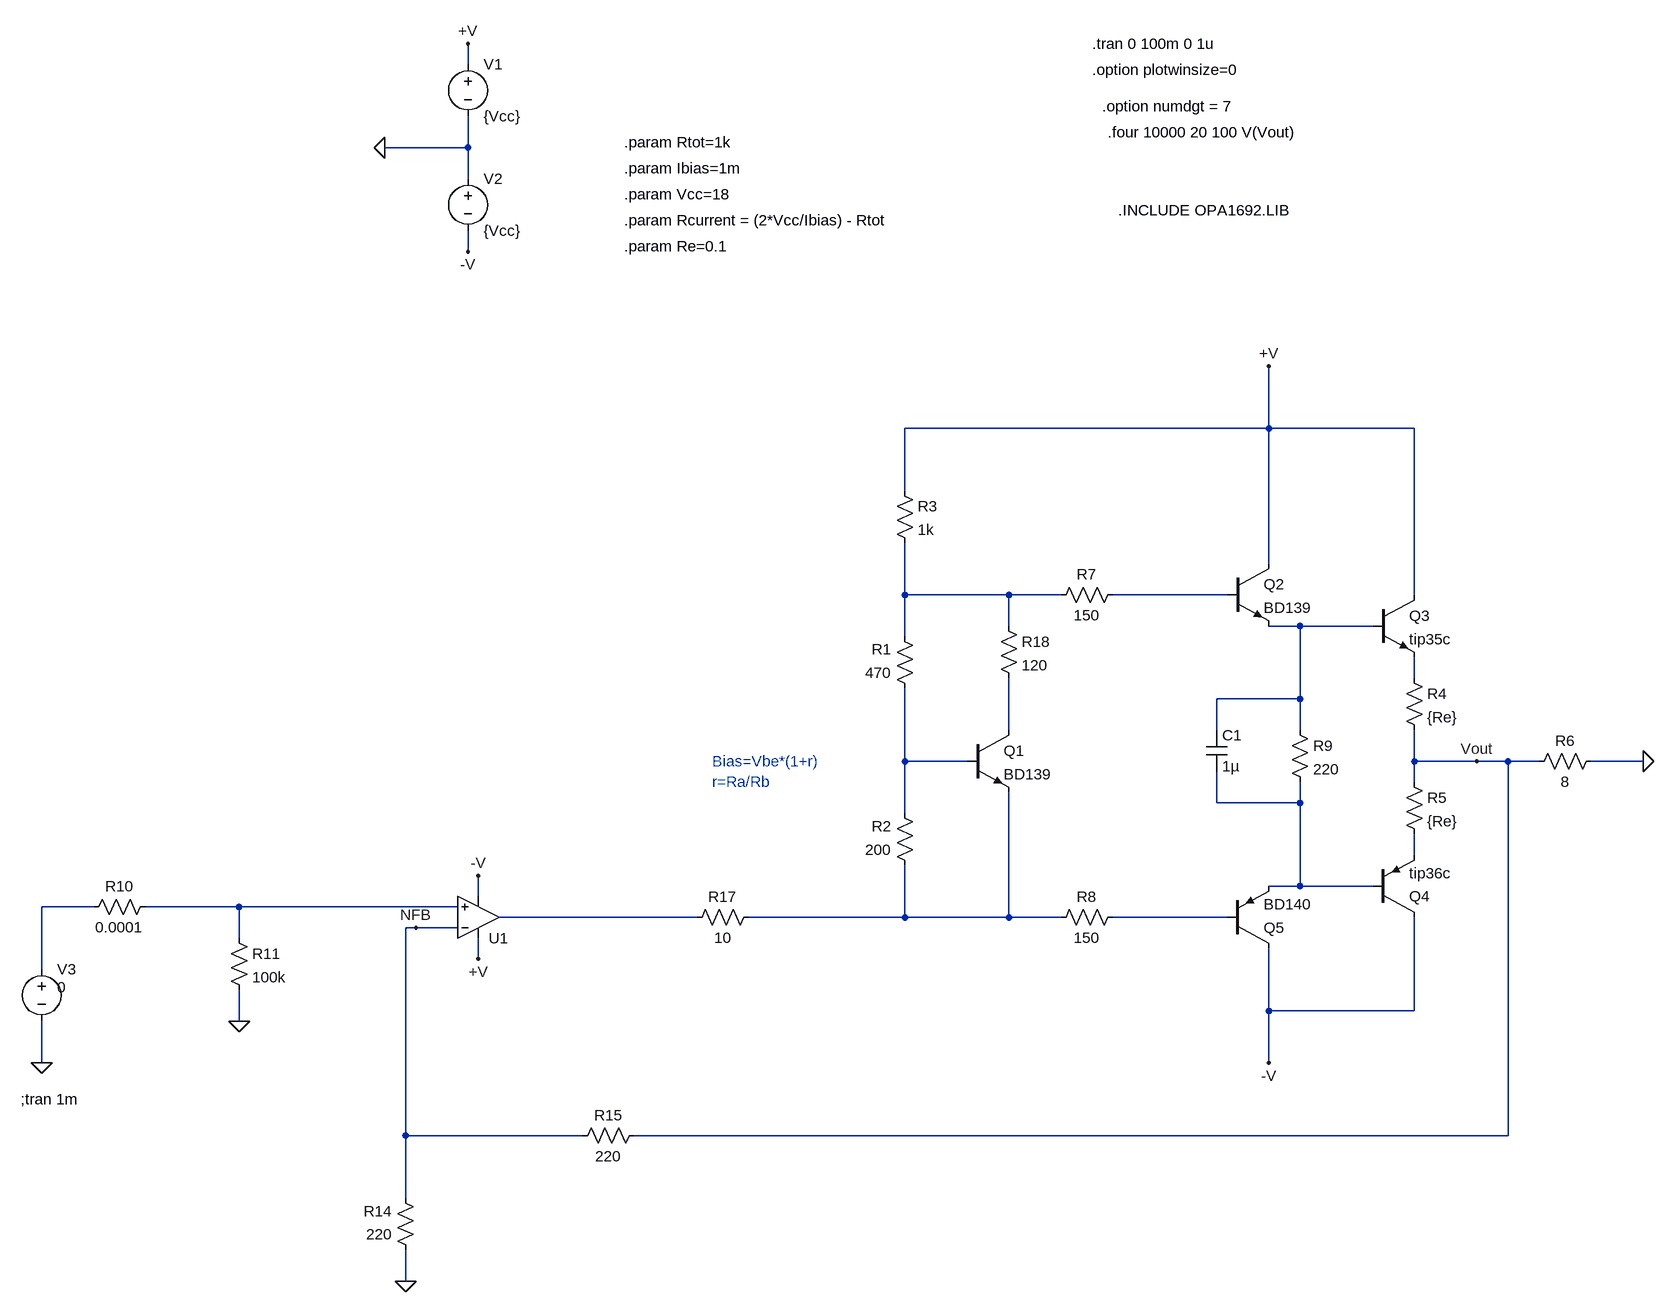
[diagram p0: schematic DC.asc]
DC.asc, the LTspice schematic file:
Version 4
SHEET 1 1236 2388
WIRE -592 -16 -592 -48
WIRE -592 112 -592 64
WIRE -592 112 -720 112
WIRE -592 160 -592 112
WIRE -592 272 -592 240
WIRE 640 544 640 448
WIRE 640 544 80 544
WIRE 864 544 640 544
WIRE 80 640 80 544
WIRE 640 752 640 544
WIRE 80 800 80 720
WIRE 240 800 80 800
WIRE 320 800 240 800
WIRE 576 800 400 800
WIRE 864 800 864 544
WIRE 240 848 240 800
WIRE 688 848 640 848
WIRE 800 848 688 848
WIRE 80 864 80 800
WIRE 864 928 864 896
WIRE 688 960 688 848
WIRE 688 960 560 960
WIRE 240 1008 240 928
WIRE 560 1008 560 960
WIRE 688 1008 688 960
WIRE 80 1056 80 944
WIRE 176 1056 80 1056
WIRE 864 1056 864 1008
WIRE 960 1056 864 1056
WIRE 1008 1056 960 1056
WIRE 1056 1056 1008 1056
WIRE 1216 1056 1136 1056
WIRE 864 1088 864 1056
WIRE 560 1120 560 1072
WIRE 688 1120 688 1088
WIRE 688 1120 560 1120
WIRE 80 1136 80 1056
WIRE 864 1200 864 1168
WIRE 688 1248 688 1120
WIRE 688 1248 640 1248
WIRE 800 1248 688 1248
WIRE -576 1264 -576 1232
WIRE -1168 1280 -1248 1280
WIRE -944 1280 -1088 1280
WIRE -608 1280 -944 1280
WIRE -240 1296 -544 1296
WIRE 80 1296 80 1216
WIRE 80 1296 -160 1296
WIRE 240 1296 240 1104
WIRE 240 1296 80 1296
WIRE 320 1296 240 1296
WIRE 576 1296 400 1296
WIRE -672 1312 -688 1312
WIRE -608 1312 -672 1312
WIRE -944 1328 -944 1280
WIRE -576 1360 -576 1328
WIRE -1248 1376 -1248 1280
WIRE 640 1440 640 1344
WIRE 864 1440 864 1296
WIRE 864 1440 640 1440
WIRE -944 1456 -944 1408
WIRE -1248 1520 -1248 1456
WIRE 640 1520 640 1440
WIRE -688 1632 -688 1312
WIRE -416 1632 -688 1632
WIRE 1008 1632 1008 1056
WIRE 1008 1632 -336 1632
WIRE -688 1728 -688 1632
WIRE -688 1856 -688 1808
FLAG -720 112 0
FLAG -592 -48 +V
FLAG -592 272 -V
FLAG 640 448 +V
FLAG 640 1520 -V
FLAG 1216 1056 0
FLAG 960 1056 Vout
FLAG -1248 1520 0
FLAG -576 1360 +V
FLAG -576 1232 -V
FLAG -944 1456 0
FLAG -672 1312 NFB
FLAG -688 1856 0
SYMBOL voltage -592 -32 R0
WINDOW 123 0 0 Left 0
WINDOW 39 0 0 Left 0
SYMATTR InstName V1
SYMATTR Value {Vcc}
SYMBOL voltage -592 144 R0
WINDOW 123 0 0 Left 0
WINDOW 39 0 0 Left 0
SYMATTR InstName V2
SYMATTR Value {Vcc}
SYMBOL res 96 960 R180
WINDOW 0 36 76 Left 2
WINDOW 3 36 40 Left 2
SYMATTR InstName R1
SYMATTR Value 470
SYMBOL res 96 1232 R180
WINDOW 0 36 76 Left 2
WINDOW 3 36 40 Left 2
SYMATTR InstName R2
SYMATTR Value 200
SYMBOL npn 176 1008 R0
SYMATTR InstName Q1
SYMATTR Value BD139
SYMBOL npn 576 752 R0
SYMATTR InstName Q2
SYMATTR Value BD139
SYMBOL npn 800 800 R0
SYMATTR InstName Q3
SYMATTR Value tip35c
SYMBOL res 64 624 R0
SYMATTR InstName R3
SYMATTR Value 1k
SYMBOL pnp 800 1296 M180
SYMATTR InstName Q4
SYMATTR Value tip36c
SYMBOL pnp 576 1344 M180
SYMATTR InstName Q5
SYMATTR Value BD140
SYMBOL res 848 912 R0
SYMATTR InstName R4
SYMATTR Value {Re}
SYMBOL res 848 1072 R0
SYMATTR InstName R5
SYMATTR Value {Re}
SYMBOL res 1152 1040 R90
WINDOW 0 0 56 VBottom 2
WINDOW 3 32 56 VTop 2
SYMATTR InstName R6
SYMATTR Value 8
SYMBOL res 416 784 R90
WINDOW 0 0 56 VBottom 2
WINDOW 3 32 56 VTop 2
SYMATTR InstName R7
SYMATTR Value 150
SYMBOL res 416 1280 R90
WINDOW 0 0 56 VBottom 2
WINDOW 3 32 56 VTop 2
SYMATTR InstName R8
SYMATTR Value 150
SYMBOL res 672 992 R0
SYMATTR InstName R9
SYMATTR Value 220
SYMBOL cap 544 1008 R0
SYMATTR InstName C1
SYMATTR Value 1µ
SYMBOL OpAmps\\opamp2 -576 1360 M180
WINDOW 3 16 96 Invisible 2
SYMATTR Value OPA1692
SYMATTR InstName U1
SYMBOL voltage -1248 1360 R0
WINDOW 123 24 124 Left 2
WINDOW 39 0 0 Left 0
WINDOW 3 24 44 Left 2
SYMATTR Value 0
SYMATTR InstName V3
SYMBOL res -1072 1264 R90
WINDOW 0 0 56 VBottom 2
WINDOW 3 32 56 VTop 2
SYMATTR InstName R10
SYMATTR Value 0.0001
SYMBOL res -960 1312 R0
SYMATTR InstName R11
SYMATTR Value 100k
SYMBOL res -672 1824 R180
WINDOW 0 36 76 Left 2
WINDOW 3 36 40 Left 2
SYMATTR InstName R14
SYMATTR Value 220
SYMBOL res -320 1616 R90
WINDOW 0 0 56 VBottom 2
WINDOW 3 32 56 VTop 2
SYMATTR InstName R15
SYMATTR Value 220
SYMBOL res -144 1280 R90
WINDOW 0 0 56 VBottom 2
WINDOW 3 32 56 VTop 2
SYMATTR InstName R17
SYMATTR Value 10
SYMBOL res 224 832 R0
SYMATTR InstName R18
SYMATTR Value 120
TEXT -352 104 Left 2 !.param Rtot=1k
TEXT -352 144 Left 2 !.param Ibias=1m
TEXT -352 184 Left 2 !.param Vcc=18
TEXT -352 224 Left 2 !.param Rcurrent = (2*Vcc/Ibias) - Rtot
TEXT -352 264 Left 2 !.param Re=0.1
TEXT 368 -48 Left 2 !.tran 0 100m 0 1u
TEXT 368 -8 Left 2 !.option plotwinsize=0
TEXT 384 48 Left 2 !.option numdgt = 7
TEXT 392 88 Left 2 !.four 10000 20 100 V(Vout)
TEXT 408 208 Left 2 !.INCLUDE OPA1692.LIB
TEXT -216 1056 Left 2 ;Bias=Vbe*(1+r)\nr=Ra/Rb
TEXT -1280 1576 Left 2 !;tran 1m

The netlist it stands for:
* DC.asc
V1 +V 0 {Vcc}
V2 0 -V {Vcc}
R1 N006 N001 470
R2 N012 N006 200
Q1 N005 N006 N012 0 BD139
Q2 +V N002 N003 0 BD139
Q3 +V N003 N004 0 tip35c
R3 +V N001 1k
Q4 -V N007 N008 0 tip36c
Q5 -V N013 N007 0 BD140
R4 N004 Vout {Re}
R5 Vout N008 {Re}
R6 0 Vout 8
R7 N002 N001 150
R8 N013 N012 150
R9 N003 N007 220
C1 N003 N007 1µ
XU1 N010 NFB +V -V N011 OPA1692  ; pins In+ In- V+ V- OUT
V3 N009 0 0
R10 N010 N009 0.0001
R11 N010 0 100k
R14 0 NFB 220
R15 Vout NFB 220
R17 N012 N011 10
R18 N001 N005 120
.model NPN NPN
.model PNP PNP
.lib standard.bjt
.param Rtot=1k
.param Ibias=1m
.param Vcc=18
.param Rcurrent = (2*Vcc/Ibias) - Rtot
.param Re=0.1
.tran 0 100m 0 1u
.option plotwinsize=0
.option numdgt = 7
.four 10000 20 100 V(Vout)
.INCLUDE OPA1692.LIB
* Bias=Vbe*(1+r)
* r=Ra/Rb
;tran 1m
.backanno
.end